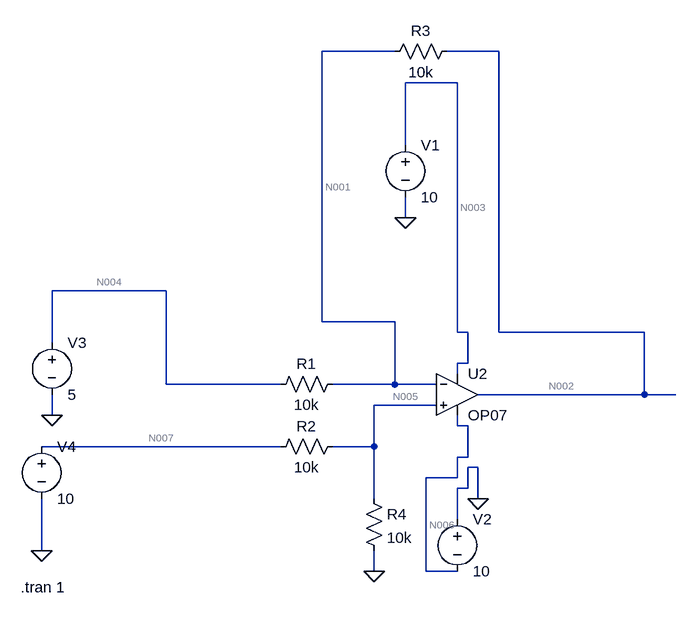
[diagram p0: schematic 1_1.asc]
1_1.asc, the LTspice schematic file:
Version 4
SHEET 1 880 680
WIRE 144 -368 32 -368
WIRE 304 -368 224 -368
WIRE 240 -320 160 -320
WIRE 160 -224 160 -320
WIRE 160 -112 160 -144
WIRE -208 0 -384 0
WIRE 32 48 32 -368
WIRE 144 48 32 48
WIRE 240 64 240 -320
WIRE 256 64 240 64
WIRE 304 64 304 -368
WIRE 528 64 304 64
WIRE -384 80 -384 0
WIRE 256 112 256 64
WIRE 256 112 240 112
WIRE 240 128 240 112
WIRE -208 144 -208 0
WIRE -32 144 -208 144
WIRE 144 144 144 48
WIRE 144 144 48 144
WIRE 208 144 144 144
WIRE 528 160 528 64
WIRE 528 160 272 160
WIRE 576 160 528 160
WIRE 208 176 112 176
WIRE -384 192 -384 160
WIRE 240 208 240 192
WIRE 256 208 240 208
WIRE -32 240 -400 240
WIRE 112 240 112 176
WIRE 112 240 48 240
WIRE 256 256 256 208
WIRE 256 256 240 256
WIRE 272 272 256 272
WIRE 240 288 240 256
WIRE 240 288 192 288
WIRE 256 304 256 272
WIRE 256 304 240 304
WIRE 112 320 112 240
WIRE 272 320 272 272
WIRE 240 352 240 304
WIRE -400 400 -400 320
WIRE 112 432 112 400
WIRE 192 432 192 288
WIRE 240 432 192 432
FLAG 272 320 0
FLAG 160 -112 0
FLAG -400 400 0
FLAG -384 192 0
FLAG 112 432 0
DATAFLAG 96 144 ""
DATAFLAG 80 240 ""
DATAFLAG 560 160 ""
SYMBOL voltage 160 -240 R0
SYMATTR InstName V1
SYMATTR Value 10
SYMBOL voltage 240 336 R0
SYMATTR InstName V2
SYMATTR Value 10
SYMBOL res 64 128 R90
WINDOW 0 0 56 VBottom 2
WINDOW 3 32 56 VTop 2
SYMATTR InstName R1
SYMATTR Value 10k
SYMBOL res 64 224 R90
WINDOW 0 0 56 VBottom 2
WINDOW 3 32 56 VTop 2
SYMATTR InstName R2
SYMATTR Value 10k
SYMBOL res 240 -384 R90
WINDOW 0 0 56 VBottom 2
WINDOW 3 32 56 VTop 2
SYMATTR InstName R3
SYMATTR Value 10k
SYMBOL res 96 304 R0
SYMATTR InstName R4
SYMATTR Value 10k
SYMBOL voltage -384 64 R0
SYMATTR InstName V3
SYMATTR Value 5
SYMBOL voltage -400 224 R0
SYMATTR InstName V4
SYMATTR Value 10
SYMBOL OpAmps\\OP07 240 96 R0
SYMATTR InstName U2
TEXT -432 456 Left 2 !.tran 1

The netlist it stands for:
* 1_1.asc
V1 N003 0 10
V2 0 N006 10
R1 N001 N004 10k
R2 N005 N007 10k
R3 N002 N001 10k
R4 N005 0 10k
V3 N004 0 5
V4 N007 0 10
XU2 N005 N001 N003 N006 N002 LT1001  ; OP07, pins In+ In- V+ V- OUT
.tran 1
.lib LTC.lib
.backanno
.end

* Results of the author's LTspice run, read from the files saved beside the schematic
* Operating Point, zero values left out:
*   V(n003) = 10 V
*   V(n006) = -10 V
*   V(n001) = 5 V
*   V(n004) = 5 V
*   V(n005) = 5 V
*   V(n007) = 10 V
*   V(n002) = 5 V
*   I(R1) = -674.4 pA
*   I(R2) = -500 µA
*   I(R3) = -665.6 pA
*   I(R4) = 500 µA
*   I(V1) = -2.25 mA
*   I(V2) = -2.25 mA
*   I(V3) = -674.4 pA
*   I(V4) = -500 µA
*   Ix(u2:1) = 9.019 pA
*   Ix(u2:2) = 8.838 pA
*   Ix(u2:3) = 2.25 mA
*   Ix(u2:4) = -2.25 mA
*   Ix(u2:5) = 655.6 pA